# EAGLE design RUDAS_KID_LOW (EAGLE 9.3.0)

## Sheet 1 of 2
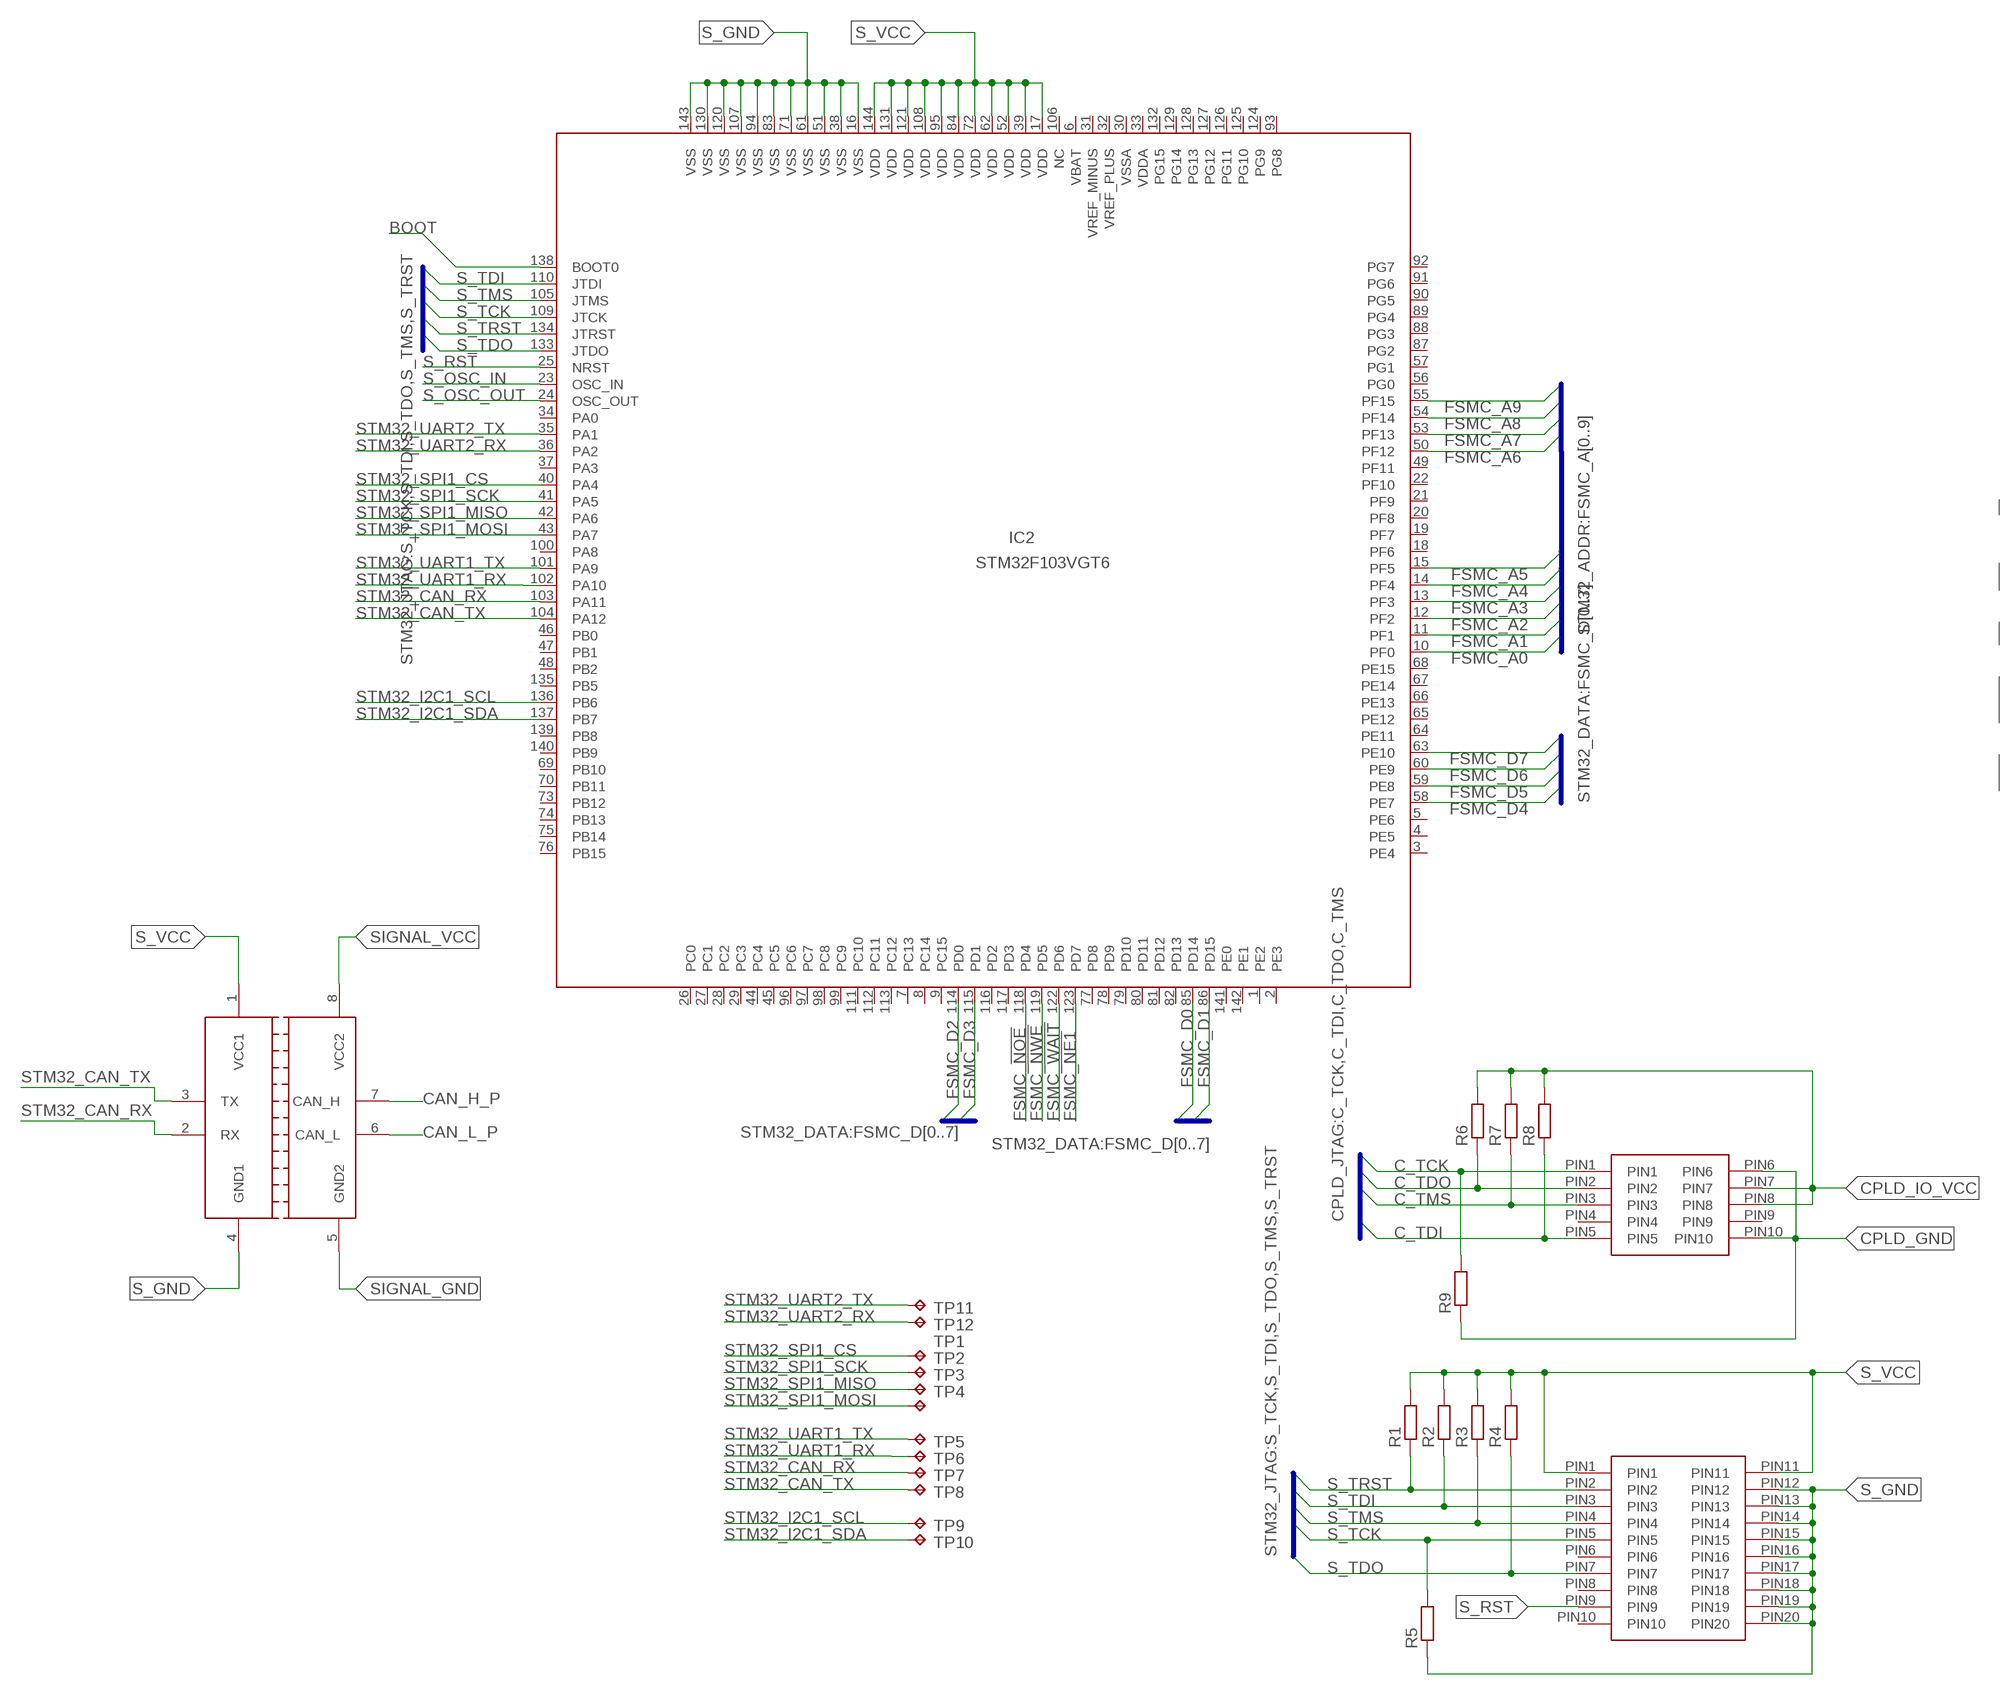
[diagram p0: schematic, sheet 1, part 1 of 2]
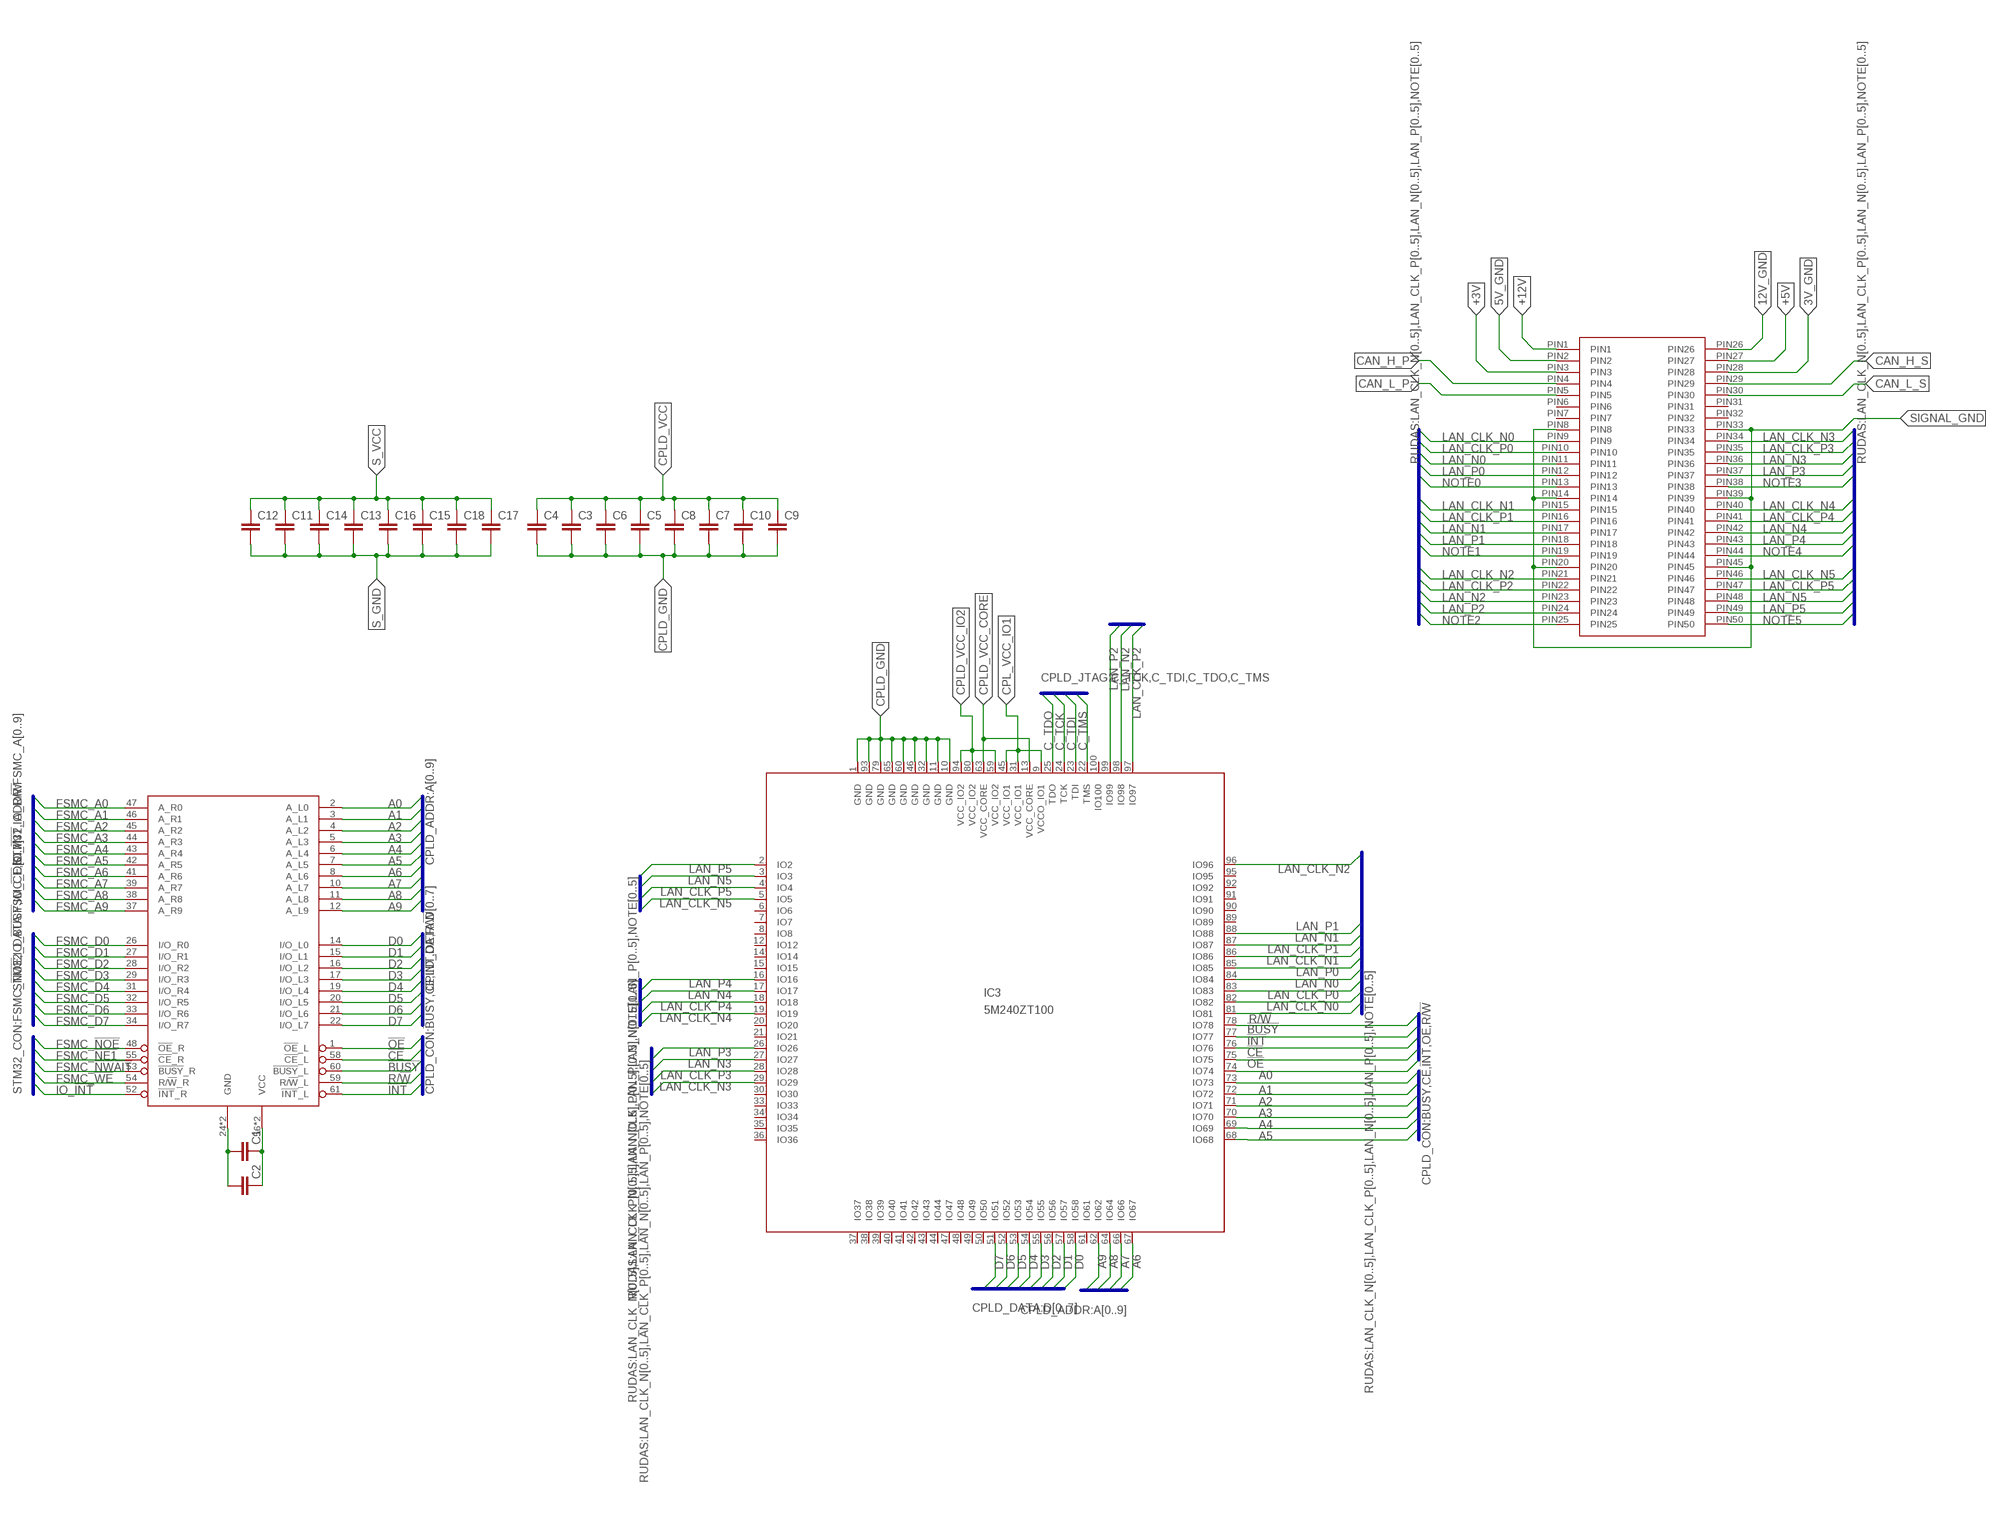
[diagram p1: schematic, sheet 1, part 2 of 2]

### Parts
C1  C-EUC2012  [C2012]
C2  C-EUC2012  [C2012]
C3  C-EUC2012  [C2012]
C4  C-EUC2012  [C2012]
C5  C-EUC2012  [C2012]
C6  C-EUC2012  [C2012]
C7  C-EUC2012  [C2012]
C8  C-EUC2012  [C2012]
C9  C-EUC2012  [C2012]
C10  C-EUC2012  [C2012]
C11  C-EUC2012  [C2012]
C12  C-EUC2012  [C2012]
C13  C-EUC2012  [C2012]
C14  C-EUC2012  [C2012]
C15  C-EUC2012  [C2012]
C16  C-EUC2012  [C2012]
C17  C-EUC2012  [C2012]
C18  C-EUC2012  [C2012]
IC2  STM32F103VGT6  STM32F1_XL_DENSITY_LQFP144  [LQFP144]
IC3  5M240ZT100  [TQFP100]
R1  R-EU_R2012  [R2012]
R2  R-EU_R2012  [R2012]
R3  R-EU_R2012  [R2012]
R4  R-EU_R2012  [R2012]
R5  R-EU_R2012  [R2012]
R6  R-EU_R2012  [R2012]
R7  R-EU_R2012  [R2012]
R8  R-EU_R2012  [R2012]
R9  R-EU_R2012  [R2012]
TP1  TP063  [TP_063]
TP2  TP063  [TP_063]
TP3  TP063  [TP_063]
TP4  TP063  [TP_063]
TP5  TP063  [TP_063]
TP6  TP063  [TP_063]
TP7  TP063  [TP_063]
TP8  TP063  [TP_063]
TP9  TP063  [TP_063]
TP10  TP063  [TP_063]
TP11  TP063  [TP_063]
TP12  TP063  [TP_063]
U$1  IDT71V30  [TQFP64]
U$2  ISO1050  [SOP8]
U$3  CONN-10PINR/A-10PIN  [R/A-10PIN]
U$4  CONN-20PINR/A-20PIN  [R/A-20PIN]
U$5  CARD_EDGE_50PINM80-5305042  [M80-5305042]

### Nets
3V_GND: U$5.PIN28
5V_GND: U$5.PIN2
12V_GND: U$5.PIN26
!BUSY!: IC3.77(IO77) U$1.60(!BUSY!_L)
!CE!: IC3.75(IO75) U$1.58(!CE!_L)
!INT!: IC3.76(IO76) U$1.61(!INT!_L)
!OE!: IC3.74(IO74) U$1.1(!OE!_L)
+3V: U$5.PIN3
+5V: U$5.PIN27
+12V: U$5.PIN1
A0: IC3.73(IO73) U$1.2(A_L0)
A1: IC3.72(IO72) U$1.3(A_L1)
A2: IC3.71(IO71) U$1.4(A_L2)
A3: IC3.70(IO70) U$1.5(A_L3)
A4: IC3.69(IO69) U$1.6(A_L4)
A5: IC3.68(IO68) U$1.7(A_L5)
A6: IC3.67(IO67) U$1.8(A_L6)
A7: IC3.66(IO66) U$1.10(A_L7)
A8: IC3.64(IO64) U$1.11(A_L8)
A9: IC3.62(IO62) U$1.12(A_L9)
BOOT: IC2.138(BOOT0)
C_TCK: IC3.24(TCK) R9.2 U$3.PIN1
C_TDI: IC3.23(TDI) R8.1 U$3.PIN5
C_TDO: IC3.25(TDO) R6.1 U$3.PIN2
C_TMS: IC3.22(TMS) R7.1 U$3.PIN3
CAN_H_P: U$2.7(CAN_H) U$5.PIN4
CAN_H_S: U$5.PIN29
CAN_L_P: U$2.6(CAN_L) U$5.PIN5
CAN_L_S: U$5.PIN30
CPL_VCC_IO1: IC3.9(VCCO_IO1) IC3.31(VCC_IO1) IC3.45(VCC_IO1)
CPLD_GND: C3.2 C4.2 C5.2 C6.2 C7.2 C8.2 C9.2 C10.2 IC3.1(GND) IC3.10(GND) IC3.11(GND) IC3.32(GND) IC3.46(GND) IC3.60(GND) IC3.65(GND) IC3.79(GND) IC3.93(GND) R9.1 U$3.PIN6 U$3.PIN10
CPLD_IO_VCC: R6.2 R7.2 R8.2 U$3.PIN7 U$3.PIN8
CPLD_VCC: C3.1 C4.1 C5.1 C6.1 C7.1 C8.1 C9.1 C10.1
CPLD_VCC_CORE: IC3.13(VCC_CORE) IC3.63(VCC_CORE)
CPLD_VCC_IO2: IC3.59(VCC_IO2) IC3.80(VCC_IO2) IC3.94(VCC_IO2)
D0: IC3.58(IO58) U$1.14(I/O_L0)
D1: IC3.57(IO57) U$1.15(I/O_L1)
D2: IC3.56(IO56) U$1.16(I/O_L2)
D3: IC3.55(IO55) U$1.17(I/O_L3)
D4: IC3.54(IO54) U$1.19(I/O_L4)
D5: IC3.53(IO53) U$1.20(I/O_L5)
D6: IC3.52(IO52) U$1.21(I/O_L6)
D7: IC3.51(IO51) U$1.22(I/O_L7)
FSMC_!NE1!: IC2.123(PD7) U$1.55(!CE!_R)
FSMC_!NOE!: IC2.118(PD4) U$1.48(!OE!_R)
FSMC_!NWAIT!: U$1.53(!BUSY!_R)
FSMC_!NWE!: IC2.119(PD5)
FSMC_!WAIT!: IC2.122(PD6)
FSMC_!WE!: U$1.54(R/!W!_R)
FSMC_A0: IC2.10(PF0) U$1.47(A_R0)
FSMC_A1: IC2.11(PF1) U$1.46(A_R1)
FSMC_A2: IC2.12(PF2) U$1.45(A_R2)
FSMC_A3: IC2.13(PF3) U$1.44(A_R3)
FSMC_A4: IC2.14(PF4) U$1.43(A_R4)
FSMC_A5: IC2.15(PF5) U$1.42(A_R5)
FSMC_A6: IC2.50(PF12) U$1.41(A_R6)
FSMC_A7: IC2.53(PF13) U$1.39(A_R7)
FSMC_A8: IC2.54(PF14) U$1.38(A_R8)
FSMC_A9: IC2.55(PF15) U$1.37(A_R9)
FSMC_D0: IC2.85(PD14) U$1.26(I/O_R0)
FSMC_D1: IC2.86(PD15) U$1.27(I/O_R1)
FSMC_D2: IC2.114(PD0) U$1.28(I/O_R2)
FSMC_D3: IC2.115(PD1) U$1.29(I/O_R3)
FSMC_D4: IC2.58(PE7) U$1.31(I/O_R4)
FSMC_D5: IC2.59(PE8) U$1.32(I/O_R5)
FSMC_D6: IC2.60(PE9) U$1.33(I/O_R6)
FSMC_D7: IC2.63(PE10) U$1.34(I/O_R7)
IO_!INT!: U$1.52(!INT!_R)
LAN_CLK_N0: IC3.81(IO81) U$5.PIN9
LAN_CLK_N1: IC3.85(IO85) U$5.PIN15
LAN_CLK_N2: IC3.96(IO96) U$5.PIN21
LAN_CLK_N3: IC3.29(IO29) U$5.PIN34
LAN_CLK_N4: IC3.19(IO19) U$5.PIN40
LAN_CLK_N5: IC3.5(IO5) U$5.PIN46
LAN_CLK_P0: IC3.82(IO82) U$5.PIN10
LAN_CLK_P1: IC3.86(IO86) U$5.PIN16
LAN_CLK_P2: IC3.97(IO97) U$5.PIN22
LAN_CLK_P3: IC3.28(IO28) U$5.PIN35
LAN_CLK_P4: IC3.18(IO18) U$5.PIN41
LAN_CLK_P5: IC3.4(IO4) U$5.PIN47
LAN_N0: IC3.83(IO83) U$5.PIN11
LAN_N1: IC3.87(IO87) U$5.PIN17
LAN_N2: IC3.98(IO98) U$5.PIN23
LAN_N3: IC3.27(IO27) U$5.PIN36
LAN_N4: IC3.17(IO17) U$5.PIN42
LAN_N5: IC3.3(IO3) U$5.PIN48
LAN_P0: IC3.84(IO84) U$5.PIN12
LAN_P1: IC3.88(IO88) U$5.PIN18
LAN_P2: IC3.99(IO99) U$5.PIN24
LAN_P3: IC3.26(IO26) U$5.PIN37
LAN_P4: IC3.16(IO16) U$5.PIN43
LAN_P5: IC3.2(IO2) U$5.PIN49
N$1: C1.1 C2.1 U$1.56(VCC) U$1.57(VCC)
N$2: C1.2 C2.2 U$1.24(GND) U$1.25(GND)
NOTE0: U$5.PIN13
NOTE1: U$5.PIN19
NOTE2: U$5.PIN25
NOTE3: U$5.PIN38
NOTE4: U$5.PIN44
NOTE5: U$5.PIN50
R/!W!: IC3.78(IO78) U$1.59(R/!W!_L)
S_GND: C11.2 C12.2 C13.2 C14.2 C15.2 C16.2 C17.2 C18.2 IC2.16(VSS) IC2.38(VSS) IC2.51(VSS) IC2.61(VSS) IC2.71(VSS) IC2.83(VSS) IC2.94(VSS) IC2.107(VSS) IC2.120(VSS) IC2.130(VSS) IC2.143(VSS) R5.1 U$2.4(GND1) U$4.PIN12 U$4.PIN13 U$4.PIN14 U$4.PIN15 U$4.PIN16 U$4.PIN17 U$4.PIN18 U$4.PIN19 U$4.PIN20
S_OSC_IN: IC2.23(OSC_IN)
S_OSC_OUT: IC2.24(OSC_OUT)
S_RST: IC2.25(NRST) U$4.PIN9
S_TCK: IC2.109(JTCK) R5.2 U$4.PIN5
S_TDI: IC2.110(JTDI) R2.1 U$4.PIN3
S_TDO: IC2.133(JTDO) R4.1 U$4.PIN7
S_TMS: IC2.105(JTMS) R3.1 U$4.PIN4
S_TRST: IC2.134(JTRST) R1.1 U$4.PIN2
S_VCC: C11.1 C12.1 C13.1 C14.1 C15.1 C16.1 C17.1 C18.1 IC2.17(VDD) IC2.39(VDD) IC2.52(VDD) IC2.62(VDD) IC2.72(VDD) IC2.84(VDD) IC2.95(VDD) IC2.108(VDD) IC2.121(VDD) IC2.131(VDD) IC2.144(VDD) R1.2 R2.2 R3.2 R4.2 U$2.1(VCC1) U$4.PIN1 U$4.PIN11
SIGNAL_GND: U$2.5(GND2) U$5.PIN8 U$5.PIN14 U$5.PIN20 U$5.PIN33 U$5.PIN39 U$5.PIN45
SIGNAL_VCC: U$2.8(VCC2)
STM32_CAN_RX: IC2.103(PA11) TP7.TP U$2.2(RX)
STM32_CAN_TX: IC2.104(PA12) TP8.TP U$2.3(TX)
STM32_I2C1_SCL: IC2.136(PB6) TP9.TP
STM32_I2C1_SDA: IC2.137(PB7) TP10.TP
STM32_SPI1_CS: IC2.40(PA4) TP1.TP
STM32_SPI1_MISO: IC2.42(PA6) TP3.TP
STM32_SPI1_MOSI: IC2.43(PA7) TP4.TP
STM32_SPI1_SCK: IC2.41(PA5) TP2.TP
STM32_UART1_RX: IC2.102(PA10) TP6.TP
STM32_UART1_TX: IC2.101(PA9) TP5.TP
STM32_UART2_RX: IC2.36(PA2) TP12.TP
STM32_UART2_TX: IC2.35(PA1) TP11.TP
Unconnected: IC2.1(PE2) IC2.2(PE3) IC2.3(PE4) IC2.4(PE5) IC2.5(PE6) IC2.6(VBAT) IC2.7(PC13) IC2.8(PC14) IC2.9(PC15) IC2.18(PF6) IC2.19(PF7) IC2.20(PF8) IC2.21(PF9) IC2.22(PF10) IC2.26(PC0) IC2.27(PC1) IC2.28(PC2) IC2.29(PC3) IC2.31(VREF_MINUS) IC2.32(VREF_PLUS) IC2.34(PA0) IC2.37(PA3) IC2.44(PC4) IC2.45(PC5) IC2.46(PB0) IC2.47(PB1) IC2.48(PB2) IC2.49(PF11) IC2.56(PG0) IC2.57(PG1) IC2.64(PE11) IC2.65(PE12) IC2.66(PE13) IC2.67(PE14) IC2.68(PE15) IC2.69(PB10) IC2.70(PB11) IC2.73(PB12) IC2.74(PB13) IC2.75(PB14) IC2.76(PB15) IC2.77(PD8) IC2.78(PD9) IC2.79(PD10) IC2.80(PD11) IC2.81(PD12) IC2.82(PD13) IC2.87(PG2) IC2.88(PG3) IC2.89(PG4) IC2.90(PG5) IC2.91(PG6) IC2.92(PG7) IC2.93(PG8) IC2.96(PC6) IC2.97(PC7) IC2.98(PC8) IC2.99(PC9) IC2.100(PA8) IC2.106(NC) IC2.111(PC10) IC2.112(PC11) IC2.113(PC12) IC2.116(PD2) IC2.117(PD3) IC2.124(PG9) IC2.125(PG10) IC2.126(PG11) IC2.127(PG12) IC2.128(PG13) IC2.129(PG14) IC2.132(PG15) IC2.135(PB5) IC2.139(PB8) IC2.140(PB9) IC2.141(PE0) IC2.142(PE1) IC3.6(IO6) IC3.7(IO7) IC3.8(IO8) IC3.12(IO12) IC3.14(IO14) IC3.15(IO15) IC3.20(IO20) IC3.21(IO21) IC3.30(IO30) IC3.33(IO33) IC3.34(IO34) IC3.35(IO35) IC3.36(IO36) IC3.37(IO37) IC3.38(IO38) IC3.39(IO39) IC3.40(IO40) IC3.41(IO41) IC3.42(IO42) IC3.43(IO43) IC3.44(IO44) IC3.47(IO47) IC3.48(IO48) IC3.49(IO49) IC3.50(IO50) IC3.61(IO61) IC3.89(IO89) IC3.90(IO90) IC3.91(IO91) IC3.92(IO92) IC3.95(IO95) IC3.100(IO100) U$3.PIN4 U$3.PIN9 U$4.PIN6 U$4.PIN8 U$4.PIN10 U$5.PIN6 U$5.PIN7 U$5.PIN31 U$5.PIN32

### Buses
CPLD_DATA:D[0..7]
CPLD_ADDR:A[0..9]
CPLD_CON:!BUSY!,!CE!,!INT!,!OE!,R/!W!
STM32_ADDR:FSMC_A[0..9]
STM32_DATA:FSMC_D[0..7]
STM32_CON:FSMC_!NOE!,IO_!BUSY!,IO_!CE!,IO_!INT!,IO_R/!W!
STM32_JTAG:S_TCK,S_TDI,S_TDO,S_TMS,S_TRST
CPLD_JTAG:C_TCK,C_TDI,C_TDO,C_TMS
RUDAS:LAN_CLK_N[0..5],LAN_CLK_P[0..5],LAN_N[0..5],LAN_P[0..5],NOTE[0..5]

## Sheet 2 of 2

## Power pins joined to a net without a drawn wire
VDDA: IC2.33(VDDA)
VSSA: IC2.30(VSSA)

## Library data of the parts
C1-C18 = rcl:C-EU: CAPACITOR, European symbol; SPICEPREFIX: C
IC2 = ORBIT-STM32F:STM32F1_XL_DENSITY_LQFP144: STM32F1_XL_density_LQFP144 edit this description Auto generated by make-symbol-device-package-bsdl.ulp Rev. 44 Source: STM32F1_XL_density_LQFP144.bsd
IC3 = ORBiT-IC-CPLD-Intel-MAX_V:5M240ZT100: 5M240ZT100 Auto generated by make-symbol-device-package-bsdl.ulp Rev. 44 This devide should suitable for any MAX V 5M240ZT100*** Source: 5M240ZT100.bsd https://www.intel.com/content/dam/altera-www/global/en_US/others/support/devices/bsdl/5M240ZT100.bsd
R1-R9 = rcl:R-EU_: RESISTOR, European symbol; SPICEPREFIX: R
TP1-TP12 = ORBiT-special:TP: Test Point, 0.063" Through-Hole
U$1 = ORBiT-IC-IDT-sram:IDT71V30
U$2 = ORBiT-IC-CAN-DRIVER:ISO1050
U$3 = ORBIT-CONN HEADER-3M-2500 Series:CONN-10PIN: 3M-CONN-RIGHT_ANGLE-10PIN CONN HEADER R/A 10POS 2.54MM N2510-5002-RB https://www.digikey.com/product-detail/en/3m/N2510-5002-RB/MHE10K-ND/755188 CONN HEADER SMD 10POS 2.54MM N2510-6V0C-RB-WD https://www.digikey.com/product-detail/en/3m/N2510-6V0C-RB-WD/MSH10KTR-ND/1125434 CONN HEADER VERT 10POS 2.54MM N2510-6002-RB https://www.digikey.com/product-detail/en/3m/N2510-6002-RB/MHC10K-ND/755176
U$4 = ORBIT-CONN HEADER-3M-2500 Series:CONN-20PIN: 3M-CONNECTOR 2500 Series CONN HEADER VERT 20POS 2.54MM N2520-6002-RB https://www.digikey.com/product-detail/en/3m/N2520-6002-RB/MHC20K-ND/755179 CONN HEADER R/A 20POS 2.54MM N2520-5002-RB https://www.digikey.com/product-detail/en/3m/N2520-5002-RB/MHE20K-ND/755191 CONN HEADER SMD 20POS 2.54MM N2520-6V0C-RB-WE https://www.digikey.com/product-detail/en/3m/N2520-6V0C-RB-WE/MSH20KCT-ND/1125449
U$5 = ORBIT-CON-HARWIN-101LOK:CARD_EDGE_50PIN: ORBIT-CON-HARWIN-101LOK-M80-4115042 Description: Headers & Wire Housings 25+25 POS FEM WO J/S 4.5mm TAIL TIN Website: https://www.mouser.com/ProductDetail/Harwin/M80-4115042?qs=sGAEpiMZZMs%252BGHln7q6pmzlZUuX%2F53qjVusOkRqubuw%3D

## Board
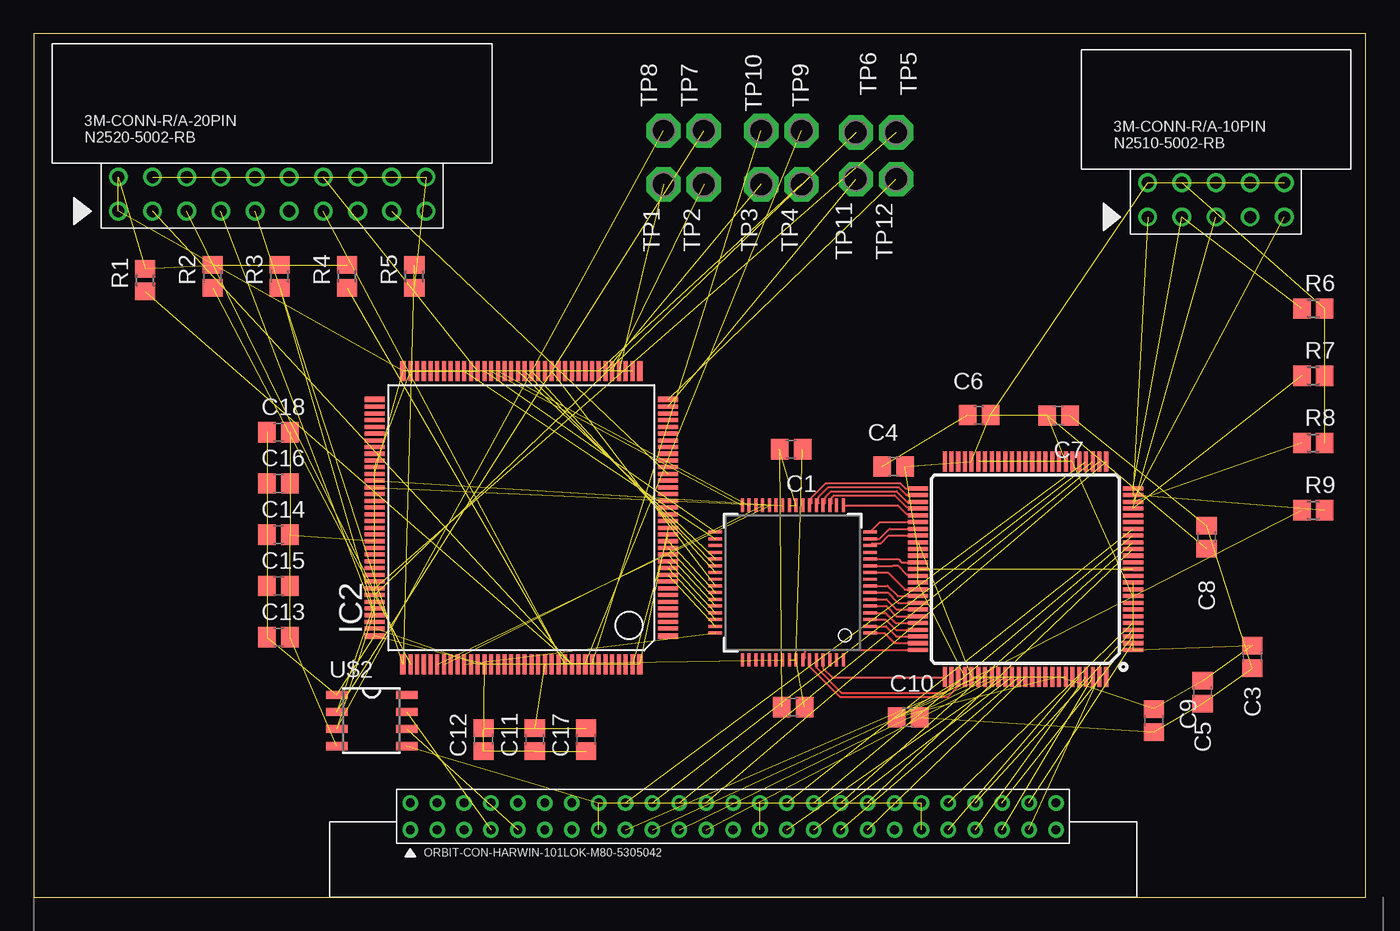
[diagram p2: board, top side]

Size 99.04 x 64.2 mm. Coordinates in mm from the lower left corner, seen from the top.
Outline: 0,0 99.04,0 99.04,64.2 0,64.2 0,0
Copper layers (1+2*15+16): Top 0.035mm / dielectric 1.5mm / Route2 0.035mm / dielectric 0.15mm / Route15 0.035mm / dielectric 0.2mm / Bottom 0.035mm
Design rules "default *": minimum track width 6mil, minimum drill 0.35mm, track to track 6mil, track to pad 6mil, pad to pad 6mil, via to via 6mil, smd to smd 6mil, copper to edge 40mil, drill to drill 6mil, minimum pad ring 10mil, minimum via ring 8mil, stop-mask expansion 4mil, vias tented up to drill 0mil, thermal gap 10mil

### Footprints (pad centres in the part's own frame; a part is rotated, then mirrored left to right if it is on the bottom)
C2012 = smd 1.3 x 1.5: 1 -0.85,0; 2 0.85,0
LQFP144 = smd 0.4 x 1.5: 1 -8.8,-10.9; 36 8.8,-10.9; 73 8.8,10.9; 108 -8.8,10.9 | smd 0.3 x 1.5: 2 -8.25,-10.9; 3 -7.75,-10.9; 4 -7.25,-10.9; 5 -6.75,-10.9; 6 -6.25,-10.9; 7 -5.75,-10.9; 8 -5.25,-10.9; 9 -4.75,-10.9; 10 -4.25,-10.9; 11 -3.75,-10.9; 12 -3.25,-10.9; 13 -2.75,-10.9; 14 -2.25,-10.9; 15 -1.75,-10.9; 16 -1.25,-10.9; 17 -0.75,-10.9; 18 -0.25,-10.9; 19 0.25,-10.9; 20 0.75,-10.9; 21 1.25,-10.9; 22 1.75,-10.9; 23 2.25,-10.9; 24 2.75,-10.9; 25 3.25,-10.9; 26 3.75,-10.9; 27 4.25,-10.9; 28 4.75,-10.9; 29 5.25,-10.9; 30 5.75,-10.9; 31 6.25,-10.9; 32 6.75,-10.9; 33 7.25,-10.9; 34 7.75,-10.9; 35 8.25,-10.9; 74 8.25,10.9; 75 7.75,10.9; 76 7.25,10.9; 77 6.75,10.9; 78 6.25,10.9; 79 5.75,10.9; 80 5.25,10.9; 81 4.75,10.9; 82 4.25,10.9; 83 3.75,10.9; 84 3.25,10.9; 85 2.75,10.9; 86 2.25,10.9; 87 1.75,10.9; 88 1.25,10.9; 89 0.75,10.9; 90 0.25,10.9; 91 -0.25,10.9; 92 -0.75,10.9; 93 -1.25,10.9; 94 -1.75,10.9; 95 -2.25,10.9; 96 -2.75,10.9; 97 -3.25,10.9; 98 -3.75,10.9; 99 -4.25,10.9; 100 -4.75,10.9; 101 -5.25,10.9; 102 -5.75,10.9; 103 -6.25,10.9; 104 -6.75,10.9; 105 -7.25,10.9; 106 -7.75,10.9; 107 -8.25,10.9 | smd 1.5 x 0.4: 37 10.9,-8.8; 72 10.9,8.8; 109 -10.9,8.8; 144 -10.9,-8.8 | smd 1.5 x 0.3: 38 10.9,-8.25; 39 10.9,-7.75; 40 10.9,-7.25; 41 10.9,-6.75; 42 10.9,-6.25; 43 10.9,-5.75; 44 10.9,-5.25; 45 10.9,-4.75; 46 10.9,-4.25; 47 10.9,-3.75; 48 10.9,-3.25; 49 10.9,-2.75; 50 10.9,-2.25; 51 10.9,-1.75; 52 10.9,-1.25; 53 10.9,-0.75; 54 10.9,-0.25; 55 10.9,0.25; 56 10.9,0.75; 57 10.9,1.25; 58 10.9,1.75; 59 10.9,2.25; 60 10.9,2.75; 61 10.9,3.25; 62 10.9,3.75; 63 10.9,4.25; 64 10.9,4.75; 65 10.9,5.25; 66 10.9,5.75; 67 10.9,6.25; 68 10.9,6.75; 69 10.9,7.25; 70 10.9,7.75; 71 10.9,8.25; 110 -10.9,8.25; 111 -10.9,7.75; 112 -10.9,7.25; 113 -10.9,6.75; 114 -10.9,6.25; 115 -10.9,5.75; 116 -10.9,5.25; 117 -10.9,4.75; 118 -10.9,4.25; 119 -10.9,3.75; 120 -10.9,3.25; 121 -10.9,2.75; 122 -10.9,2.25; 123 -10.9,1.75; 124 -10.9,1.25; 125 -10.9,0.75; 126 -10.9,0.25; 127 -10.9,-0.25; 128 -10.9,-0.75; 129 -10.9,-1.25; 130 -10.9,-1.75; 131 -10.9,-2.25; 132 -10.9,-2.75; 133 -10.9,-3.25; 134 -10.9,-3.75; 135 -10.9,-4.25; 136 -10.9,-4.75; 137 -10.9,-5.25; 138 -10.9,-5.75; 139 -10.9,-6.25; 140 -10.9,-6.75; 141 -10.9,-7.25; 142 -10.9,-7.75; 143 -10.9,-8.25
TQFP100 = smd 1.5 x 0.3: 1 -8,6; 2 -8,5.5; 3 -8,5; 4 -8,4.5; 5 -8,4; 6 -8,3.5; 7 -8,3; 8 -8,2.5; 9 -8,2; 10 -8,1.5; 11 -8,1; 12 -8,0.5; 13 -8,0; 14 -8,-0.5; 15 -8,-1; 16 -8,-1.5; 17 -8,-2; 18 -8,-2.5; 19 -8,-3; 20 -8,-3.5; 21 -8,-4; 22 -8,-4.5; 23 -8,-5; 24 -8,-5.5; 25 -8,-6; 51 8,-6; 52 8,-5.5; 53 8,-5; 54 8,-4.5; 55 8,-4; 56 8,-3.5; 57 8,-3; 58 8,-2.5; 59 8,-2; 60 8,-1.5; 61 8,-1; 62 8,-0.5; 63 8,0; 64 8,0.5; 65 8,1; 66 8,1.5; 67 8,2; 68 8,2.5; 69 8,3; 70 8,3.5; 71 8,4; 72 8,4.5; 73 8,5; 74 8,5.5; 75 8,6 | smd 0.3 x 1.5: 26 -6,-8; 27 -5.5,-8; 28 -5,-8; 29 -4.5,-8; 30 -4,-8; 31 -3.5,-8; 32 -3,-8; 33 -2.5,-8; 34 -2,-8; 35 -1.5,-8; 36 -1,-8; 37 -0.5,-8; 38 0,-8; 39 0.5,-8; 40 1,-8; 41 1.5,-8; 42 2,-8; 43 2.5,-8; 44 3,-8; 45 3.5,-8; 46 4,-8; 47 4.5,-8; 48 5,-8; 49 5.5,-8; 50 6,-8; 76 6,8; 77 5.5,8; 78 5,8; 79 4.5,8; 80 4,8; 81 3.5,8; 82 3,8; 83 2.5,8; 84 2,8; 85 1.5,8; 86 1,8; 87 0.5,8; 88 0,8; 89 -0.5,8; 90 -1,8; 91 -1.5,8; 92 -2,8; 93 -2.5,8; 94 -3,8; 95 -3.5,8; 96 -4,8; 97 -4.5,8; 98 -5,8; 99 -5.5,8; 100 -6,8
R2012 = smd 1.3 x 1.5: 1 -0.85,0; 2 0.85,0
TP_063 = drill 1.6 pad 2.54 octagon: TP 0,0
TQFP64 = smd 1 x 0.22: 1 -5.75,3.75; 2 -5.75,3.25; 3 -5.75,2.75; 4 -5.75,2.25; 5 -5.75,1.75; 6 -5.75,1.25; 7 -5.75,0.75; 8 -5.75,0.25; 9 -5.75,-0.25; 10 -5.75,-0.75; 11 -5.75,-1.25; 12 -5.75,-1.75; 13 -5.75,-2.25; 14 -5.75,-2.75; 15 -5.75,-3.25; 16 -5.75,-3.75; 33 5.75,-3.75; 34 5.75,-3.25; 35 5.75,-2.75; 36 5.75,-2.25; 37 5.75,-1.75; 38 5.75,-1.25; 39 5.75,-0.75; 40 5.75,-0.25; 41 5.75,0.25; 42 5.75,0.75; 43 5.75,1.25; 44 5.75,1.75; 45 5.75,2.25; 46 5.75,2.75; 47 5.75,3.25; 48 5.75,3.75 | smd 0.22 x 1: 17 -3.75,-5.75; 18 -3.25,-5.75; 19 -2.75,-5.75; 20 -2.25,-5.75; 21 -1.75,-5.75; 22 -1.25,-5.75; 23 -0.75,-5.75; 24 -0.25,-5.75; 25 0.25,-5.75; 26 0.75,-5.75; 27 1.25,-5.75; 28 1.75,-5.75; 29 2.25,-5.75; 30 2.75,-5.75; 31 3.25,-5.75; 32 3.75,-5.75; 49 3.75,5.75; 50 3.25,5.75; 51 2.75,5.75; 52 2.25,5.75; 53 1.75,5.75; 54 1.25,5.75; 55 0.75,5.75; 56 0.25,5.75; 57 -0.25,5.75; 58 -0.75,5.75; 59 -1.25,5.75; 60 -1.75,5.75; 61 -2.25,5.75; 62 -2.75,5.75; 63 -3.25,5.75; 64 -3.75,5.75
SOP8 = smd 0.6 x 1.6: 1 -1.905,-2.6; 2 -0.635,-2.6; 3 0.635,-2.6; 4 1.905,-2.6; 5 1.905,2.6; 6 0.635,2.6; 7 -0.635,2.6; 8 -1.905,2.6
R/A-10PIN = drill 0.889: PIN1 0,0; PIN2 2.54,0; PIN3 5.08,0; PIN4 7.62,0; PIN5 10.16,0; PIN6 0,2.54; PIN7 2.54,2.54; PIN8 5.08,2.54; PIN9 7.62,2.54; PIN10 10.16,2.54
R/A-20PIN = drill 0.889: PIN1 0,0; PIN2 2.54,0; PIN3 5.08,0; PIN4 7.62,0; PIN5 10.16,0; PIN6 12.7,0; PIN7 15.24,0; PIN8 17.78,0; PIN9 20.32,0; PIN10 22.86,0; PIN11 0,2.54; PIN12 2.54,2.54; PIN13 5.08,2.54; PIN14 7.62,2.54; PIN15 10.16,2.54; PIN16 12.7,2.54; PIN17 15.24,2.54; PIN18 17.78,2.54; PIN19 20.32,2.54; PIN20 22.86,2.54
M80-5305042 = drill 0.65: PIN1 0,-1; PIN2 2,-1; PIN3 4,-1; PIN4 6,-1; PIN5 8,-1; PIN6 10,-1; PIN7 12,-1; PIN8 14,-1; PIN9 16,-1; PIN10 18,-1; PIN11 20,-1; PIN12 22,-1; PIN13 24,-1; PIN14 26,-1; PIN15 28,-1; PIN16 30,-1; PIN17 32,-1; PIN18 34,-1; PIN19 36,-1; PIN20 38,-1; PIN21 40,-1; PIN22 42,-1; PIN23 44,-1; PIN24 46,-1; PIN25 48,-1; PIN26 0,1; PIN27 2,1; PIN28 4,1; PIN29 6,1; PIN30 8,1; PIN31 10,1; PIN32 12,1; PIN33 14,1; PIN34 16,1; PIN35 18,1; PIN36 20,1; PIN37 22,1; PIN38 24,1; PIN39 26,1; PIN40 28,1; PIN41 30,1; PIN42 32,1; PIN43 34,1; PIN44 36,1; PIN45 38,1; PIN46 40,1; PIN47 42,1; PIN48 44,1; PIN49 46,1; PIN50 48,1

### Placement (x,y rotation side)
C1  56.31,33.29 180 top
C2  56.46,14.12 180 top
C3  90.6,17.86 90 top
C4  63.93,32.02 0 top
C5  86.9,15.24 90 top
C6  70.28,35.83 0 top
C7  76.2,35.81 180 top
C8  87.2,26.75 270 top
C9  83.28,13.13 90 top
C10  65.02,13.36 180 top
C11  37.26,11.7 90 top
C12  33.45,11.7 90 top
C13  18.21,19.32 0 top
C14  18.21,26.94 0 top
C15  18.21,23.13 0 top
C16  18.21,30.75 0 top
C17  41.07,11.7 90 top
C18  18.21,34.56 0 top
IC2  36.26,28.21 90 top
IC3  73.73,24.38 180 top
R1  8.3,45.87 90 top
R2  13.3,46.14 90 top
R3  18.3,46.14 90 top
R4  23.3,46.14 90 top
R5  28.3,46.14 90 top
R6  95.13,43.76 0 top
R7  95.13,38.76 0 top
R8  95.13,33.76 0 top
R9  95.13,28.76 0 top
TP1  46.82,52.99 90 top
TP2  49.82,52.99 90 top
TP3  54.09,52.99 90 top
TP4  57.09,52.99 90 top
TP5  64.12,56.85 270 top
TP6  61.12,56.85 270 top
TP7  49.82,56.99 270 top
TP8  46.82,56.99 270 top
TP9  57.09,56.99 270 top
TP10  54.09,56.99 270 top
TP11  61.12,53.39 90 top
TP12  64.12,53.39 90 top
U$1  56.44,23.38 180 top
U$2  25.13,13.13 270 top
U$3  82.82,50.57 0 top
U$4  6.3,51 0 top
U$5  28,6 0 top

### Tracks (layer width: path | path; a pad name or v marks a point on that pad's centre or on a via)
!BUSY!
  Top 0.152: U$1.60 58.19,17.07 60.06,15.19 67.77,15.19 68.11,15.54 68.11,16.26 IC3.77
!CE!
  Top 0.152: U$1.58 57.35,17.8 57.35,18.23 57.5,18.38 IC3.75
!INT!
  Top 0.152: U$1.61 58.69,17.02 59.37,16.34 67.71,16.34 67.73,16.36 IC3.76
!OE!
  Top 0.152: U$1.1 63.25,19.63 64,18.88 IC3.74
A0
  Top 0.152: U$1.2 63.38,20.13 64.13,19.38 IC3.73
A1
  Top 0.152: U$1.3 63.33,20.63 64.09,19.88 IC3.72
A2
  Top 0.152: U$1.4 63.32,21.13 64.08,20.38 IC3.71
A3
  Top 0.152: U$1.5 63.39,21.63 64.14,20.88 IC3.70
A4
  Top 0.152: U$1.6 63.4,22.13 64.16,21.38 IC3.69
A5
  Top 0.152: U$1.7 63.51,22.63 64.27,21.88 IC3.68
A6
  Top 0.152: U$1.8 63.48,23.13 63.48,23.14 64.25,22.38 IC3.67
A7
  Top 0.152: U$1.10 63.49,24.13 64.76,22.86 65.71,22.86 IC3.66
A8
  Top 0.152: U$1.11 63.88,24.63 63.88,24.64 64.24,24.64 64.89,24 65.61,24 IC3.64
A9
  Top 0.152: U$1.12 64.27,25.13 64.53,24.88 IC3.62
C_TCK  (2 unrouted)
C_TDI  (2 unrouted)
C_TDO  (2 unrouted)
C_TMS  (2 unrouted)
CAN_H_P  (1 unrouted)
CAN_L_P  (1 unrouted)
CPL_VCC_IO1  (2 unrouted)
CPLD_GND  (19 unrouted)
CPLD_IO_VCC  (4 unrouted)
CPLD_VCC  (7 unrouted)
CPLD_VCC_CORE  (1 unrouted)
CPLD_VCC_IO2  (2 unrouted)
D0
  Top 0.152: U$1.14 62.35,26.3 62.98,26.3 63.56,26.88 IC3.58
D1
  Top 0.152: U$1.15 62.88,26.63 63.63,27.38 IC3.57
D2
  Top 0.152: U$1.16 62.93,27.88 IC3.56
D3
  Top 0.152: IC3.55 65.61,28.5 64.89,28.5 64.25,29.13 U$1.17
D4
  Top 0.152: IC3.54 65.61,29 64.89,29 64.02,29.86 59.48,29.86 59.35,29.73 59.35,29.3 U$1.19
D5
  Top 0.152: U$1.20 58.85,29.3 58.85,29.73 59.29,30.17 64.15,30.17 64.94,29.38 IC3.53
D6
  Top 0.152: U$1.21 58.35,29.3 58.35,29.73 59.09,30.47 64.28,30.47 64.87,29.88 IC3.52
D7
  Top 0.152: U$1.22 57.85,29.3 57.85,29.73 58.9,30.78 64.4,30.78 64.8,30.38 IC3.51
FSMC_!NE1!  (1 unrouted)
FSMC_!NOE!  (1 unrouted)
FSMC_A0  (1 unrouted)
FSMC_A1  (1 unrouted)
FSMC_A2  (1 unrouted)
FSMC_A3  (1 unrouted)
FSMC_A4  (1 unrouted)
FSMC_A5  (1 unrouted)
FSMC_A6  (1 unrouted)
FSMC_A7  (1 unrouted)
FSMC_A8  (1 unrouted)
FSMC_A9  (1 unrouted)
FSMC_D0  (1 unrouted)
FSMC_D1  (1 unrouted)
FSMC_D2  (1 unrouted)
FSMC_D3  (1 unrouted)
FSMC_D4  (1 unrouted)
FSMC_D5  (1 unrouted)
FSMC_D6  (1 unrouted)
FSMC_D7  (1 unrouted)
LAN_CLK_N0  (1 unrouted)
LAN_CLK_N1  (1 unrouted)
LAN_CLK_N2  (1 unrouted)
LAN_CLK_N3  (1 unrouted)
LAN_CLK_N4  (1 unrouted)
LAN_CLK_N5  (1 unrouted)
LAN_CLK_P0  (1 unrouted)
LAN_CLK_P1  (1 unrouted)
LAN_CLK_P2  (1 unrouted)
LAN_CLK_P3  (1 unrouted)
LAN_CLK_P4  (1 unrouted)
LAN_CLK_P5  (1 unrouted)
LAN_N0  (1 unrouted)
LAN_N1  (1 unrouted)
LAN_N2  (1 unrouted)
LAN_N3  (1 unrouted)
LAN_N4  (1 unrouted)
LAN_N5  (1 unrouted)
LAN_P0  (1 unrouted)
LAN_P1  (1 unrouted)
LAN_P2  (1 unrouted)
LAN_P3  (1 unrouted)
LAN_P4  (1 unrouted)
LAN_P5  (1 unrouted)
N$1  (3 unrouted)
N$2  (3 unrouted)
R/!W!
  Top 0.152: U$1.59 57.69,17.13 59.93,14.89 67.96,14.89 68.73,15.66 IC3.78
S_GND  (29 unrouted)
S_RST  (1 unrouted)
S_TCK  (2 unrouted)
S_TDI  (2 unrouted)
S_TDO  (2 unrouted)
S_TMS  (2 unrouted)
S_TRST  (2 unrouted)
S_VCC  (25 unrouted)
SIGNAL_GND  (6 unrouted)
STM32_CAN_RX  (2 unrouted)
STM32_CAN_TX  (2 unrouted)
STM32_I2C1_SCL  (1 unrouted)
STM32_I2C1_SDA  (1 unrouted)
STM32_SPI1_CS  (1 unrouted)
STM32_SPI1_MISO  (1 unrouted)
STM32_SPI1_MOSI  (1 unrouted)
STM32_SPI1_SCK  (1 unrouted)
STM32_UART1_RX  (1 unrouted)
STM32_UART1_TX  (1 unrouted)
STM32_UART2_RX  (1 unrouted)
STM32_UART2_TX  (1 unrouted)